# EAGLE design DenScript Potentiometer V1.0 (EAGLE 9.1.0)
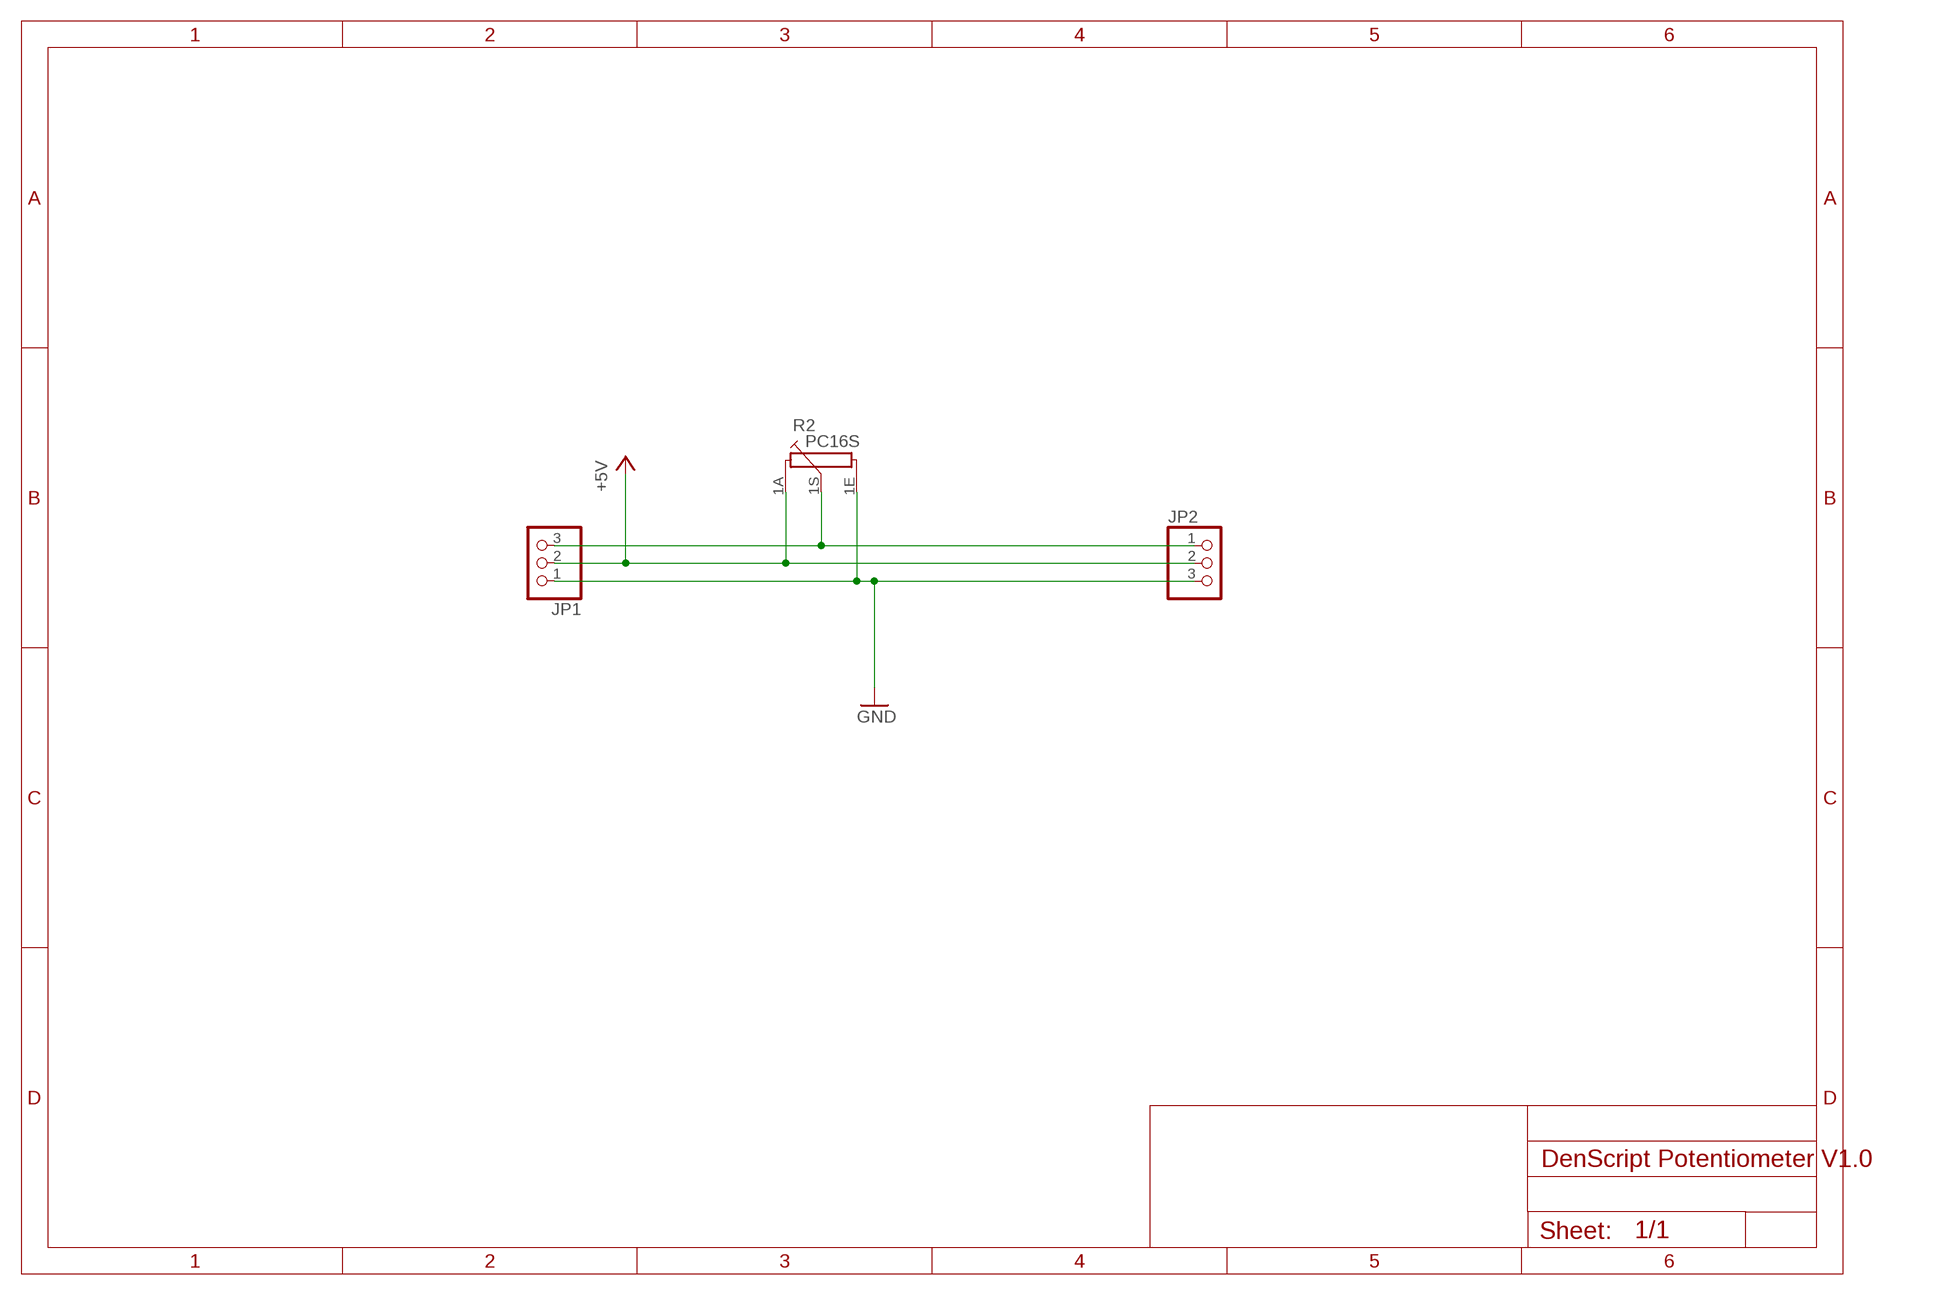
[diagram p0: schematic, sheet 1]

## Parts
JP1  PINHD-1X3  [1X03]
JP2  PINHD-1X3  [1X03]
R2  PC16S  [PC16S]

## Nets
+5V: JP1.2 JP2.2 R2.1A
GND: JP1.1 JP2.3 R2.1E
N$1: JP1.3 JP2.1 R2.1S

## Library data of the parts
JP1 JP2 = adafruit:PINHD-1X3: PIN HEADER
R2 = piher:PC16S: POTENTIOMETER single carbon potentiometer, 16 mm, S3ROH; OC_FARNELL: 4452940; OC_NEWARK: unknown

## Board
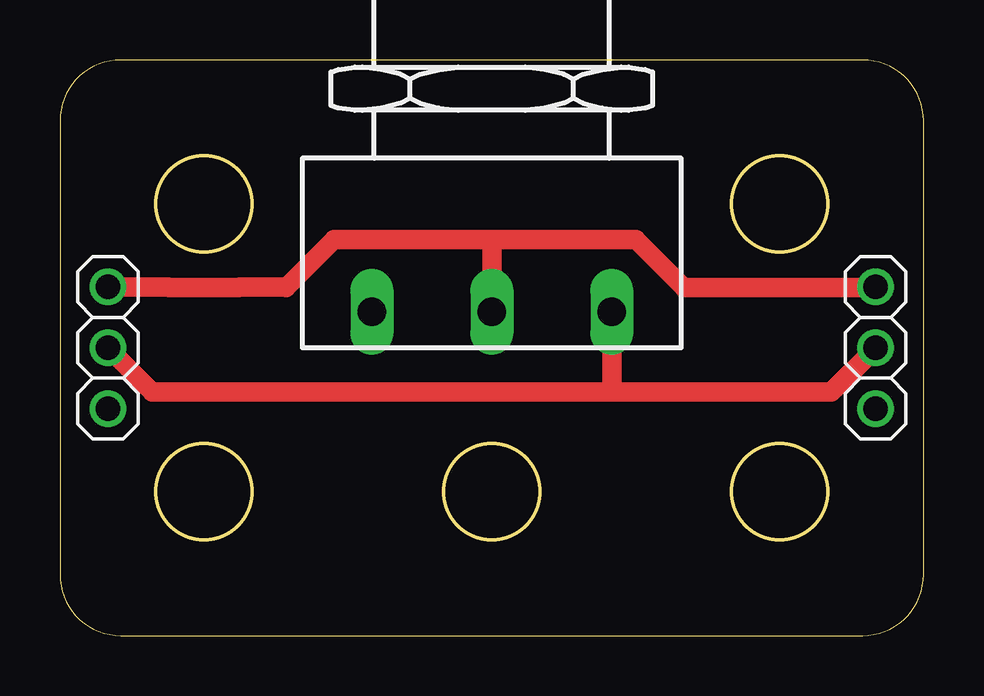
[diagram p1: board, top side]
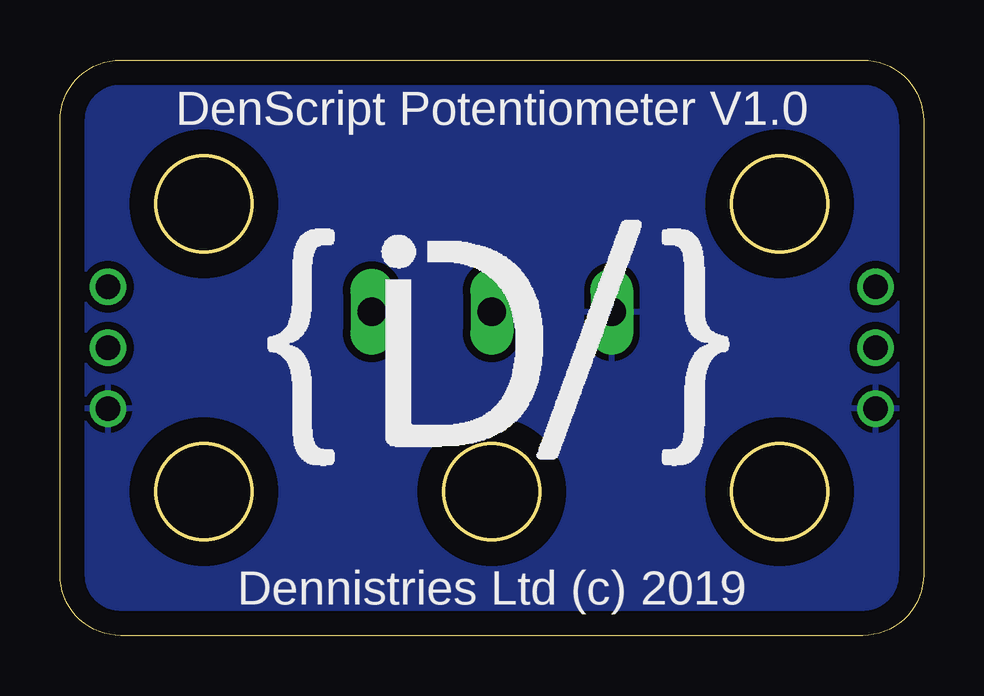
[diagram p2: board, bottom side, seen from below]

Size 36 x 24 mm. Coordinates in mm from the lower left corner, seen from the top.
Outline: 36,2.54 36,21.46 arc90 33.46,24 2.54,24 arc90 0,21.46 0,2.54 arc90 2.54,0 33.46,0 arc90 36,2.54
Outline: circle at 6,18 radius 2
Outline: circle at 6,6 radius 2
Outline: circle at 30,18 radius 2
Outline: circle at 18,6 radius 2
Outline: circle at 30,6 radius 2
Copper layers (1*16): Top 0.035mm / dielectric 1.5mm / Bottom 0.035mm
Design rules "default": minimum track width 6mil, minimum drill 0.35mm, track to track 6mil, track to pad 6mil, pad to pad 6mil, via to via 6mil, smd to smd 6mil, copper to edge 40mil, drill to drill 6mil, minimum pad ring 10mil, minimum via ring 8mil, stop-mask expansion 4mil, vias tented up to drill 0mil, thermal gap 10mil

### Footprints (pad centres in the part's own frame; a part is rotated, then mirrored left to right if it is on the bottom)
1X03 = drill 1.016: 1 -2.54,0; 2 0,0; 3 2.54,0
PC16S = drill 1.2 long: 1A -5,6.5; 1E 5,6.5; 1S 0,6.5

### Placement (x,y rotation side)
JP1  2,12 90 top
JP2  34,12 270 top
R2  18,20 180 top

### Tracks (layer width: path | path; a pad name or v marks a point on that pad's centre or on a via)
+5V
  Top 0.813: JP1.2 3.84,10.16 22.86,10.16 | JP2.2 32.16,10.16 22.86,10.16 | R2.1A 23,10.3 22.86,10.16
GND
  pour Bottom (isolate 0.305): 0,0 36.83,0 36.83,24.13 0,24.13
N$1  (via drill 0.35)
  Top 0.813: 17.78,16.51 11.43,16.51 9.42,14.5 9.38,14.54 7.49,14.54 7.45,14.5 4.55,14.5 4.51,14.54 JP1.3 | 17.78,16.51 24,16.51 26.01,14.5 v33.96,14.5 | R2.1S 18,16.29 17.78,16.51
  Bottom 0.813: v33.96,14.5 JP2.1

### Text on the board
bPlace: DenScript Potentiometer V1.0 | Dennistries Ltd (c) 2019